# EAGLE design powercommander (EAGLE 6.4)
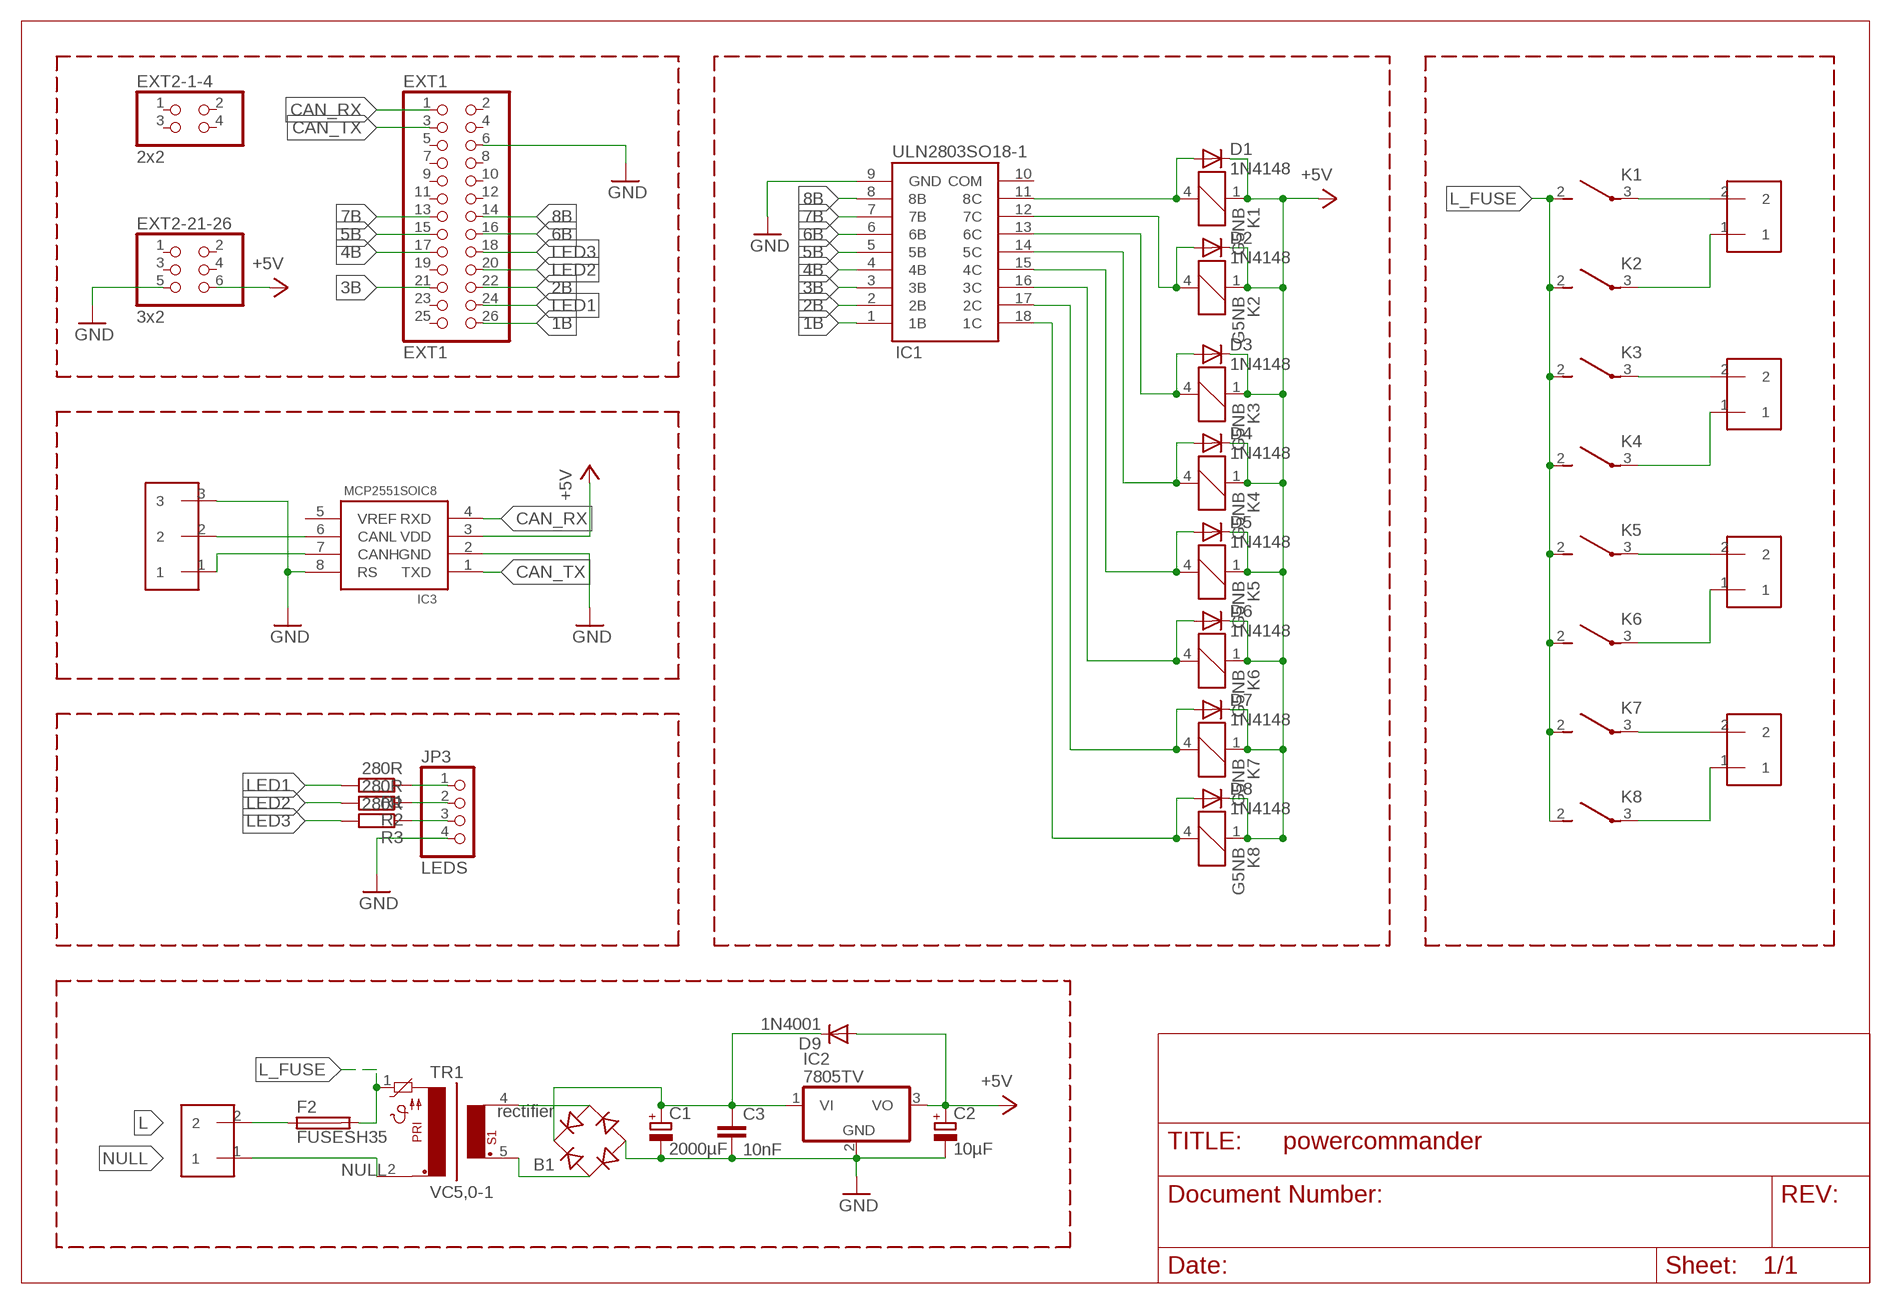
[diagram p0: schematic, sheet 1]

## Parts
B1  rectifier  RB1A  [RB1A]
C1  2000µF  CPOL-EUE5-8.5  [E5-8,5]
C2  10µF  CPOL-EUE5-8.5  [E5-8,5]
C3  10nF  C-EU025-025X050  [C025-025X050]
D1  1N4148  DIODE-SOD323-W  [SOD323-W]
D2  1N4148  DIODE-SOD323-W  [SOD323-W]
D3  1N4148  DIODE-SOD323-W  [SOD323-W]
D4  1N4148  DIODE-SOD323-W  [SOD323-W]
D5  1N4148  DIODE-SOD323-W  [SOD323-W]
D6  1N4148  DIODE-SOD323-W  [SOD323-W]
D7  1N4148  DIODE-SOD323-W  [SOD323-W]
D8  1N4148  DIODE-SOD323-W  [SOD323-W]
D9  1N4001  DIODE-MELF-MLL41  [MELF-MLL41]
EXT1  EXT1  PINHD-2X13  [2X13]
EXT2-1-4  2x2  PINHD-2X2  [2X02]
EXT2-21-26  3x2  PINHD-2X3  [2X03]
F2  FUSESH35  [SH25]
IC1  ULN2803SO18-1  [SO18-1]
IC2  7805TV  [TO220V]
IC3  MCP2551SOIC8  [SOIC-08LG]
JP3  LEDS  PINHD-1X4  [1X04]
K1  G5NB  [G5NB]
K2  G5NB  [G5NB]
K3  G5NB  [G5NB]
K4  G5NB  [G5NB]
K5  G5NB  [G5NB]
K6  G5NB  [G5NB]
K7  G5NB  [G5NB]
K8  G5NB  [G5NB]
PHASE  2KLEMME  [W237-102]
R1  280R  R-EU_0204/7  [0204/7]
R2  280R  R-EU_0204/7  [0204/7]
R3  280R  R-EU_0204/7  [0204/7]
TR1  VC5,0-1  [VC5,0-1]
X2  3KLEMME  [W237-103]
X3  2KLEMME  [W237-102]
X4  2KLEMME  [W237-102]
X5  2KLEMME  [W237-102]
X6  2KLEMME  [W237-102]

## Nets
1B: EXT1.26 IC1.1(1B)
2B: EXT1.22 IC1.2(2B)
3B: EXT1.21 IC1.3(3B)
4B: EXT1.17 IC1.4(4B)
5B: EXT1.15 IC1.5(5B)
6B: EXT1.16 IC1.6(6B)
7B: EXT1.13 IC1.7(7B)
8B: EXT1.14 IC1.8(8B)
+5V: C2.+ D1.C D2.C D3.C D4.C D5.C D6.C D7.C D8.C D9.A EXT2-21-26.6 IC2.3(VO) IC3.3(VDD) K1.1 K2.1 K3.1 K4.1 K5.1 K6.1 K7.1 K8.1
A1: K1.3 X3.2
A3: K3.3 X4.2
A5: K5.3 X5.2
A7: K7.3 X6.2
CAN_RX: EXT1.1 IC3.4(RXD)
CAN_TX: EXT1.3 IC3.1(TXD)
GND: B1.- C1.- C2.- C3.2 EXT1.6 EXT2-21-26.5 IC1.9(GND) IC2.2(GND) IC3.2(GND) IC3.8(RS) JP3.4 X2.3
L: F2.1 PHASE.2
L_FUSE: F2.2 K1.2 K2.2 K3.2 K4.2 K5.2 K6.2 K7.2 K8.2 TR1.1
LED1: EXT1.24 R1.2
LED2: EXT1.20 R2.2
LED3: EXT1.18 R3.2
N$2: IC3.7(CANH) X2.1
N$3: B1.AC2 TR1.4
N$4: B1.AC1 TR1.5
N$5: B1.+ C1.+ C3.1 D9.C IC2.1(VI)
N$6: IC3.6(CANL) X2.2
N$9: K4.3 X4.1
N$10: D2.A IC1.12(7C) K2.4
N$11: D3.A IC1.13(6C) K3.4
N$12: K6.3 X5.1
N$13: K8.3 X6.1
N$14: K2.3 X3.1
N$15: D7.A IC1.17(2C) K7.4
N$20: D1.A IC1.11(8C) K1.4
N$24: D8.A IC1.18(1C) K8.4
N$26: D6.A IC1.16(3C) K6.4
N$27: D5.A IC1.15(4C) K5.4
N$28: D4.A IC1.14(5C) K4.4
N$32: JP3.1 R1.1
N$36: JP3.2 R2.1
N$37: JP3.3 R3.1
NULL: PHASE.1 TR1.2
Unconnected: EXT1.2 EXT1.4 EXT1.5 EXT1.7 EXT1.8 EXT1.9 EXT1.10 EXT1.11 EXT1.12 EXT1.19 EXT1.23 EXT1.25 EXT2-1-4.1 EXT2-1-4.2 EXT2-1-4.3 EXT2-1-4.4 EXT2-21-26.1 EXT2-21-26.2 EXT2-21-26.3 EXT2-21-26.4 IC1.10(COM) IC3.5(VREF)

## Library data of the parts
B1 = rectifier:RB1A: RECTIFIER 1 A
C1 C2 = rcl:CPOL-EU: POLARIZED CAPACITOR, European symbol
C3 = rcl:C-EU: CAPACITOR, European symbol
D1-D9 = diode:DIODE-: DIODE
EXT1 = pinhead:PINHD-2X13: PIN HEADER
EXT2-1-4 = pinhead:PINHD-2X2: PIN HEADER
EXT2-21-26 = pinhead:PINHD-2X3: PIN HEADER
F2 = fuse:FUSE: Fuse; OC_FARNELL: unknown; OC_NEWARK: unknown
IC1 = personal-parts:ULN2803
IC2 = linear:78*: Positive VOLTAGE REGULATOR Source: http://cache.national.com/ds/LM/LM78L05.pdf http://www.fairchildsemi.com/ds/LM/LM7805.pdf
IC3 = personal-parts:MCP2551
JP3 = pinhead:PINHD-1X4: PIN HEADER
K1-K8 = relay-omron-G5NB:G5NB: Compact Single-pole Relay for Switching 5 A Source: http://www.omron.com/ecb/products/pry/121/g5sb.html; OC_FARNELL: unknown; OC_NEWARK: unknown
PHASE X3-X6 = personal-parts:2KLEMME
R1-R3 = rcl:R-EU_: RESISTOR, European symbol
TR1 = personal-parts:VC5,0-1: TRANSFORMER 1 primary winding, temp. protection fuse, 2 secondary windings/ mounting hole BLOCK
X2 = personal-parts:3KLEMME

## Board
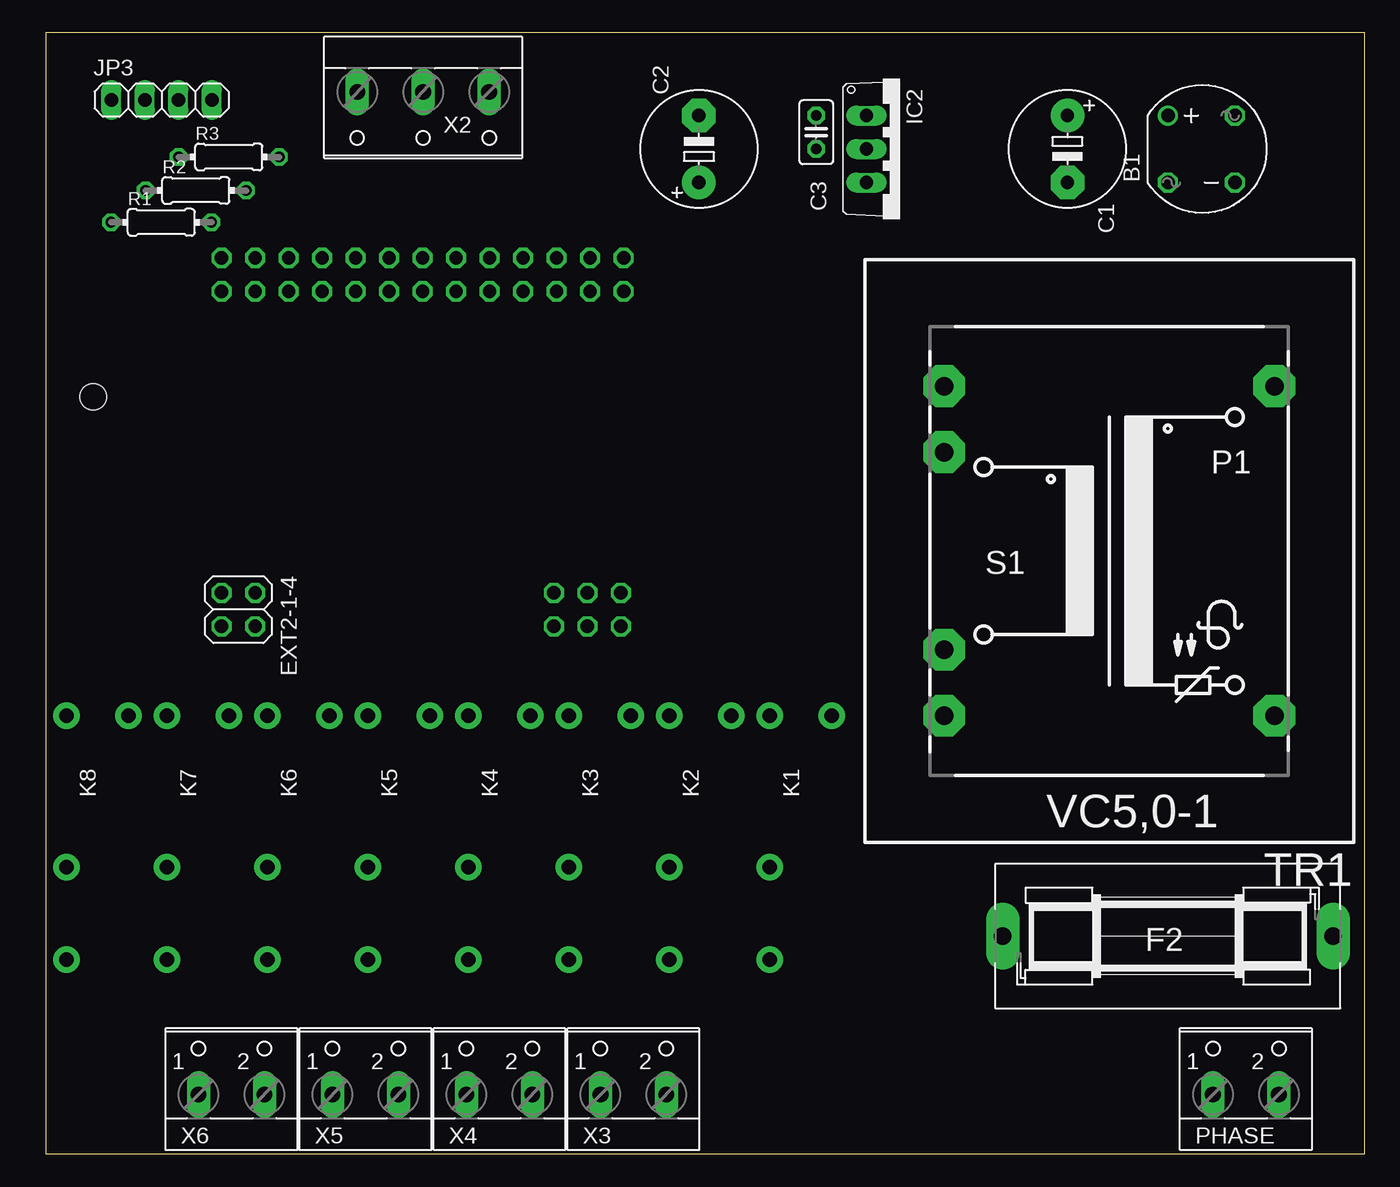
[diagram p1: board, top side]
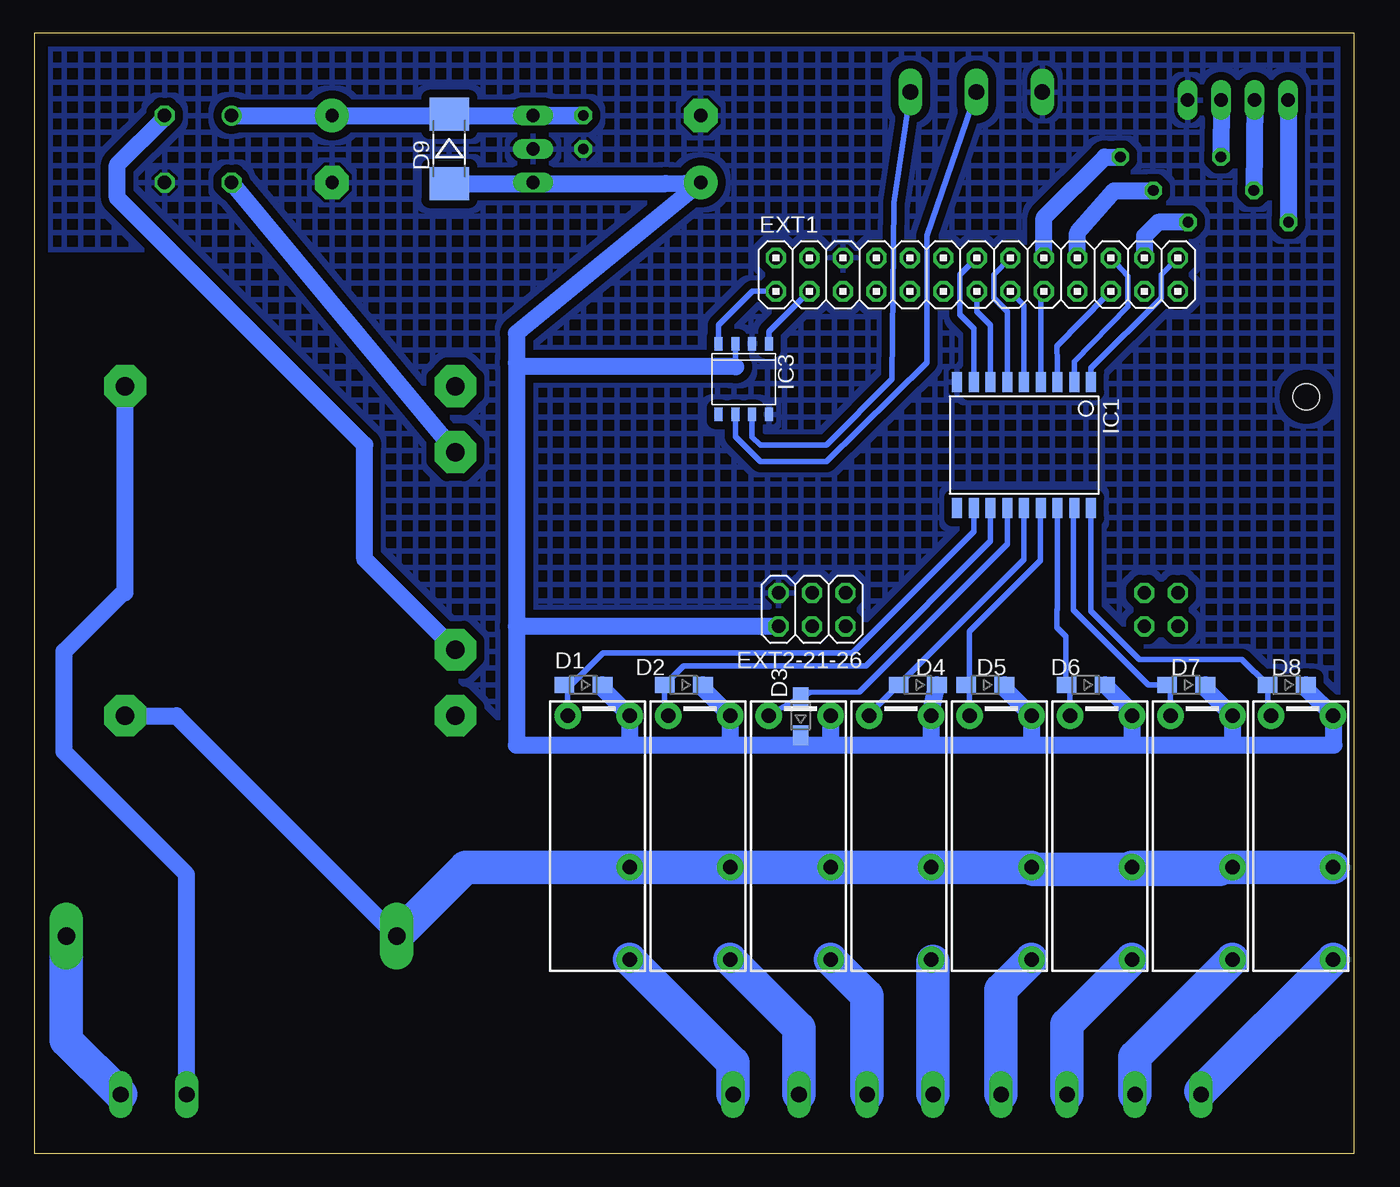
[diagram p2: board, bottom side, seen from below]

Size 100 x 85 mm. Coordinates in mm from the lower left corner, seen from the top.
Outline: 100,0 100,85 0,85 0,0 100,0
Copper layers (1*16): Top 0.035mm / dielectric 1.5mm / Bottom 0.035mm
Design rules "default": minimum track width 10mil, minimum drill 24mil, track to track 8mil, track to pad 8mil, pad to pad 8mil, via to via 8mil, smd to smd 8mil, copper to edge 40mil, drill to drill 8mil, minimum pad ring 10mil, minimum via ring 8mil, stop-mask expansion 4mil, vias tented up to drill 0mil, thermal gap 10mil
Holes 2 mm at 3.6,57.4

### Footprints (pad centres in the part's own frame; a part is rotated, then mirrored left to right if it is on the bottom)
RB1A = drill 1.016: + -2.54,2.54 | drill 1.016 octagon: - 2.54,-2.54; AC1 2.54,2.54; AC2 -2.54,-2.54
E5-8,5 = drill 1.016 pad 2.54: + -2.54,0 | drill 1.016 pad 2.54 octagon: - 2.54,0
C025-025X050 = drill 0.813 octagon: 1 -1.27,0; 2 1.27,0
SOD323-W = smd 1.5 x 1.2: A 1.45,0; C -1.45,0
MELF-MLL41 = smd 2.5 x 3: A 2.625,0; C -2.625,0
2X13 = drill 1.016 octagon: 1 -15.24,-1.27; 2 -15.24,1.27; 3 -12.7,-1.27; 4 -12.7,1.27; 5 -10.16,-1.27; 6 -10.16,1.27; 7 -7.62,-1.27; 8 -7.62,1.27; 9 -5.08,-1.27; 10 -5.08,1.27; 11 -2.54,-1.27; 12 -2.54,1.27; 13 0,-1.27; 14 0,1.27; 15 2.54,-1.27; 16 2.54,1.27; 17 5.08,-1.27; 18 5.08,1.27; 19 7.62,-1.27; 20 7.62,1.27; 21 10.16,-1.27; 22 10.16,1.27; 23 12.7,-1.27; 24 12.7,1.27; 25 15.24,-1.27; 26 15.24,1.27
2X02 = drill 1.016 octagon: 1 -1.27,-1.27; 2 -1.27,1.27; 3 1.27,-1.27; 4 1.27,1.27
2X03 = drill 1.016 octagon: 1 -2.54,-1.27; 2 -2.54,1.27; 3 0,-1.27; 4 0,1.27; 5 2.54,-1.27; 6 2.54,1.27
SH25 = drill 1.321 pad 2.54 long: 1 -12.522,0; 2 12.522,0
SO18-1 = smd 0.762 x 1.524: 1 -5.08,-4.775; 2 -3.81,-4.775; 3 -2.54,-4.775; 4 -1.27,-4.775; 5 0,-4.775; 6 1.27,-4.775; 7 2.54,-4.775; 8 3.81,-4.775; 9 5.08,-4.775; 10 5.08,4.775; 11 3.81,4.775; 12 2.54,4.775; 13 1.27,4.775; 14 0,4.775; 15 -1.27,4.775; 16 -2.54,4.775; 17 -3.81,4.775; 18 -5.08,4.775
TO220V = drill 1.016 long: 1 -2.54,-2.54; 2 0,-2.54; 3 2.54,-2.54
SOIC-08LG = smd 0.6 x 1: 1 -1.905,-2.675; 2 -0.635,-2.675; 3 0.635,-2.675; 4 1.905,-2.675; 5 1.905,2.675; 6 0.635,2.675; 7 -0.635,2.675; 8 -1.905,2.675
1X04 = drill 1.016 long: 1 -3.81,0; 2 -1.27,0; 3 1.27,0; 4 3.81,0
G5NB = drill 1.1 pad 2: 1 -9.11,-2.24; 2 2.39,-2.24; 3 9.39,-2.24; 4 -9.11,2.46
W237-102 = drill 1.194 long: 1 -2.5,0; 2 2.5,0
0204/7 = drill 0.813 octagon: 1 -3.81,0; 2 3.81,0
VC5,0-1 = drill 1.397 pad 3.175 octagon: 1 -12.522,12.497; 2 -12.522,-12.497; 3 12.522,-12.497; 4 12.522,-7.493; 5 12.522,7.493; 6 12.522,12.497
W237-103 = drill 1.194 long: 1 -5,-0.02; 2 0,-0.02; 3 5,-0.02

### Placement (x,y rotation side)
B1  87.63,76.2 0 top
C1  77.47,76.2 270 top
C2  49.53,76.2 90 top
C3  58.42,77.47 270 top
D1  58.42,35.56 180 bottom
D2  50.8,35.56 180 bottom
D3  41.94,33.18 90 bottom
D4  33.06,35.56 180 bottom
D5  27.94,35.56 180 bottom
D6  20.32,35.56 180 bottom
D7  12.7,35.56 180 bottom
D8  5.08,35.56 180 bottom
D9  68.58,76.2 270 bottom
EXT1  28.57,66.67 0 bottom
EXT2-1-4  14.61,41.27 270 top
EXT2-21-26  41.08,41.27 180 bottom
F2  85.09,16.51 180 top
IC1  25,53.75 180 bottom
IC2  64.77,76.2 270 top
IC3  46.25,58.75 180 bottom
JP3  8.78,79.92 0 top
K1  57.15,24.13 270 top
K2  49.53,24.13 270 top
K3  41.91,24.13 270 top
K4  34.29,24.13 270 top
K5  26.67,24.13 270 top
K6  19.05,24.13 270 top
K7  11.43,24.13 270 top
K8  3.81,24.13 270 top
PHASE  91,4.5 0 top
R1  8.76,70.64 0 top
R2  11.38,73.06 0 top
R3  13.88,75.6 0 top
TR1  80.64,45.72 180 top
X2  28.62,80.5 180 top
X3  44.56,4.5 0 top
X4  34.4,4.5 0 top
X5  24.24,4.5 0 top
X6  14.08,4.5 0 top

### Tracks (layer width: path | path; a pad name or v marks a point on that pad's centre or on a via)
1B
  Bottom 0.406: IC1.1 19.92,59.58 14.61,64.9 14.61,66.67 EXT1.26
2B
  Bottom 0.406: IC1.2 21.19,60.09 17.14,64.26 17.14,66.55 EXT1.22
3B
  Bottom 0.406: IC1.3 22.46,60.04 22.5,61.25 18.75,65.07 EXT1.21
4B
  Bottom 0.406: IC1.4 23.73,65.17 EXT1.17
5B
  Bottom 0.406: IC1.5 25,64.37 EXT1.15
6B
  Bottom 0.406: IC1.6 26.27,63.86 27.3,64.9 27.3,66.67 EXT1.16
7B
  Bottom 0.406: EXT1.13 28.57,63.88 27.54,62.85 IC1.7
8B
  Bottom 0.406: IC1.8 28.81,62.59 29.84,63.63 29.84,66.67 EXT1.14
+5V
  Bottom 0.406: 62.23,73.58 IC2.3 | 63.49,40.01 63.5,40 | D3.C 41.94,31.94 42,32 42,31 | IC3.3 46.86,61.42 46.86,59.69 | 63.19,59.69 63.5,60
  Bottom 1.27: D9.A 62.23,73.58 52.16,73.58 C2.+ 63.5,62.23 63.5,60 63.5,40 63.5,31 54.91,31 | 54.91,31 47.29,31 | 47.29,31 42,31 39.67,31 | 39.67,31 32.05,31 | 32.05,31 24.43,31 | 24.43,31 16.81,31 | 16.81,31 9.19,31 | 9.19,31 1.57,31 | 1.57,31 K8.1 3.63,35.3 D8.C | 1.57,31 1.5,31 | 9.19,31 K7.1 11.25,35.3 D7.C | 24.43,31 K5.1 26.49,35.3 D5.C | 32.05,31 K4.1 32.05,33.5 D4.C | 16.81,31 K6.1 16.81,33.5 D6.C | K3.1 39.67,31 | 47.29,31 K2.1 49.35,35.3 D2.C | 54.91,31 K1.1 56.97,35.3 D1.C | 46.86,59.69 63.19,59.69 | EXT2-21-26.6 63.49,40.01
A1
  Bottom 2.54: X3.2 47.06,6.89 K1.3
A3
  Bottom 2.54: K3.3 36.9,11.97 X4.2
A5
  Bottom 2.54: K5.3 26.74,12.43 X5.2
A7
  Bottom 2.54: K7.3 16.58,7.35 X6.2
CAN_RX
  Bottom 0.406: EXT1.1 45.59,65.41 48.16,62.84 IC3.4
CAN_TX
  Bottom 0.406: EXT1.3 44.34,62.34 IC3.1
GND
  pour Bottom (isolate 0.61, hatched): -5.08,34.27 -5.08,88.9 104.14,88.9 104.14,68.56 91.44,68.56 76.22,53.34 76.2,44.27 62.23,30.44 0,30.44
L
  Bottom 2.54: F2.1 97.61,8.61 PHASE.2
L_FUSE
  Bottom 0.406: K6.2 10.31,21.74 10.16,21.59 | 24.28,21.59 K5.2
  Bottom 1.27: F2.2 89.28,33.22 TR1.1
  Bottom 2.54: K8.2 K7.2 K6.2 | 10.16,21.59 24.28,21.59 | K5.2 K4.2 K3.2 K2.2 K1.2 67.34,21.74 F2.2
LED1
  Bottom 1.27: R1.2 14.83,70.64 15.88,69.6 EXT1.24
LED2
  Bottom 1.27: EXT1.20 20.95,69.85 18.16,73.03 R2.2
LED3
  Bottom 1.27: EXT1.18 23.5,70.99 18.89,75.6 R3.2
N$2
  Bottom 0.406: IC3.7 45.62,54.37 45,53.75 40,53.75 35,58.75 34.87,72.14 X2.1
N$3
  Bottom 1.27: TR1.4 B1.AC2
N$4
  Bottom 1.27: TR1.5 75,45.1 75,53.75 93.75,72.5 93.75,75 90.17,78.58 B1.AC1
N$5
  Bottom 0.406: D9.C 68.58,78.74
  Bottom 1.27: B1.+ C1.+ 68.58,78.74 C3.1 IC2.1
N$6
  Bottom 0.406: IC3.6 46.88,54.38 45,52.5 40,52.5 32.37,60 32.37,69.64 X2.2
N$9
  Bottom 1.27: K4.3 31.9,14.59
  Bottom 2.54: 31.9,14.59 X4.1
N$10
  Bottom 0.406: K2.4 52.25,33.5 D2.A 50.81,37 37,37 27.54,46.46 IC1.12
N$11
  Bottom 0.406: K3.4 D3.A 41.25,35 37.49,35.01 26.25,46.25 26.25,48.95 IC1.13
N$12
  Bottom 2.54: K6.3 21.74,9.81 X5.1
N$13
  Bottom 1.27: X6.1 11.58,4.73
  Bottom 2.54: 11.58,4.73 K8.3
N$14
  Bottom 2.54: K2.3 42.06,9.51 X3.1
N$15
  Bottom 0.406: K7.4 13.89,35.56 D7.A 15.56,35.56 21.25,41.25 21.25,48.91 IC1.17
N$20
  Bottom 0.406: K1.4 59.61,35.3 | 59.61,35.3 D1.A | 59.61,35.3 56.91,38 38,38 28.81,47.19 IC1.11
N$24
  Bottom 0.406: K8.4 6.53,33.24 D8.A 8.47,37.5 16.25,37.5 19.92,41.17 IC1.18
N$26
  Bottom 0.406: K6.4 21.51,35.56 D6.A 21.84,35.63 21.84,39.24 22.5,39.9 22.5,41.25 22.46,41.29 IC1.16
N$27
  Bottom 0.406: K5.4 29.13,35.56 | 29.13,35.56 D5.A | 29.13,35.56 29.13,39.62 23.75,45 23.75,48.95 IC1.15
N$28
  Bottom 0.406: K4.4 36.75,33.32 D4.A 25,45.07 IC1.14
N$32
  Bottom 1.27: JP3.1 R1.1
N$36
  Bottom 1.27: JP3.2 R2.1
N$37
  Bottom 1.27: JP3.3 R3.1
NULL
  Bottom 0.406: 93.34,42.55 93.17,42.55
  Bottom 1.27: 93.34,42.55 97.79,38.1 97.79,30.48 88.5,21.19 PHASE.1 | 93.17,42.55 TR1.2